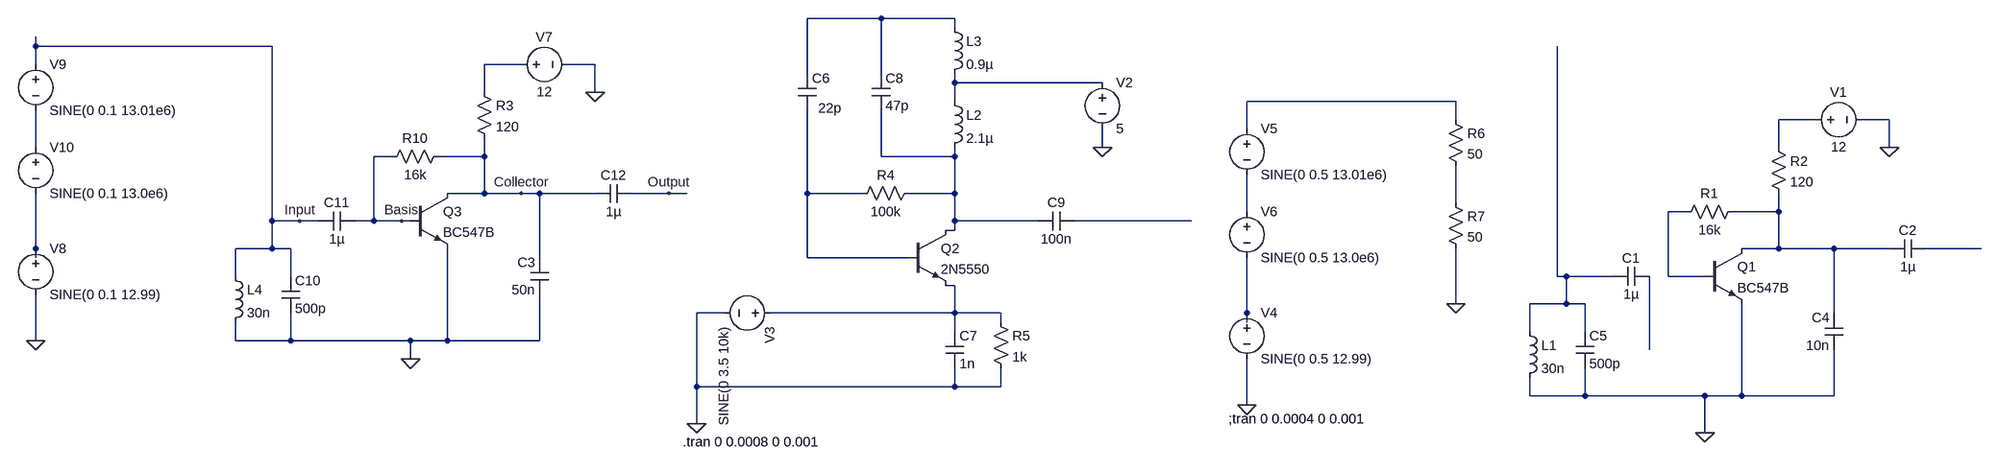
[diagram p0: schematic EmpfängerRadioWorking!!!!!!.asc]
EmpfängerRadioWorking!!!!!!.asc, the LTspice schematic file:
Version 4
SHEET 1 5860 680
WIRE 3872 -224 3744 -224
WIRE 4000 -224 3872 -224
WIRE 4000 -208 4000 -224
WIRE 1584 -176 1584 -192
WIRE 2816 -176 1584 -176
WIRE 1584 -144 1584 -176
WIRE 3248 -144 3184 -144
WIRE 3376 -144 3328 -144
WIRE 3744 -128 3744 -224
WIRE 3872 -128 3872 -224
WIRE 4000 -112 4000 -128
WIRE 4256 -112 4000 -112
WIRE 3184 -96 3184 -144
WIRE 3376 -96 3376 -144
WIRE 4000 -80 4000 -112
WIRE 4944 -80 4560 -80
WIRE 4944 -48 4944 -80
WIRE 5568 -48 5504 -48
WIRE 5696 -48 5648 -48
WIRE 4560 -32 4560 -80
WIRE 1584 0 1584 -64
WIRE 4256 0 4256 -32
WIRE 5504 0 5504 -48
WIRE 5696 0 5696 -48
WIRE 3024 16 2992 16
WIRE 3184 16 3184 -16
WIRE 3184 16 3104 16
WIRE 3872 16 3872 -64
WIRE 4000 16 4000 0
WIRE 4000 16 3872 16
WIRE 3184 80 3184 16
WIRE 3184 80 3120 80
WIRE 3248 80 3184 80
WIRE 3280 80 3248 80
WIRE 3376 80 3280 80
WIRE 3504 80 3440 80
WIRE 3536 80 3504 80
WIRE 3744 80 3744 -64
WIRE 3840 80 3744 80
WIRE 4000 80 4000 16
WIRE 4000 80 3920 80
WIRE 4944 96 4944 32
WIRE 4560 112 4560 48
WIRE 5344 112 5312 112
WIRE 5504 112 5504 80
WIRE 5504 112 5424 112
WIRE 2816 128 2816 -176
WIRE 2864 128 2816 128
WIRE 2896 128 2864 128
WIRE 2992 128 2992 16
WIRE 2992 128 2960 128
WIRE 3040 128 2992 128
WIRE 3056 128 3040 128
WIRE 4000 128 4000 80
WIRE 4144 128 4000 128
WIRE 4464 128 4208 128
WIRE 4000 144 4000 128
WIRE 4000 144 3984 144
WIRE 1584 176 1584 80
WIRE 2816 176 2816 128
WIRE 2816 176 2752 176
WIRE 2848 176 2816 176
WIRE 5504 176 5504 112
WIRE 5504 176 5440 176
WIRE 5600 176 5504 176
WIRE 5696 176 5600 176
WIRE 5856 176 5760 176
WIRE 1584 192 1584 176
WIRE 3280 192 3280 80
WIRE 3744 192 3744 80
WIRE 3920 192 3744 192
WIRE 2752 224 2752 176
WIRE 2848 224 2848 176
WIRE 5120 224 5120 -176
WIRE 5136 224 5120 224
WIRE 5216 224 5136 224
WIRE 5312 224 5312 112
WIRE 5376 224 5312 224
WIRE 4000 240 3984 240
WIRE 4944 272 4944 176
WIRE 5136 272 5136 224
WIRE 5136 272 5072 272
WIRE 5168 272 5136 272
WIRE 3600 288 3552 288
WIRE 4000 288 4000 240
WIRE 4000 288 3680 288
WIRE 4080 288 4000 288
WIRE 4560 288 4560 192
WIRE 5600 288 5600 176
WIRE 4080 304 4080 288
WIRE 4560 304 4560 288
WIRE 4000 320 4000 288
WIRE 5072 320 5072 272
WIRE 5168 320 5168 272
WIRE 1584 336 1584 256
WIRE 2752 336 2752 304
WIRE 2848 336 2848 288
WIRE 2848 336 2752 336
WIRE 3056 336 2848 336
WIRE 3120 336 3120 176
WIRE 3120 336 3056 336
WIRE 3280 336 3280 256
WIRE 3280 336 3120 336
WIRE 5280 352 5280 224
WIRE 3056 368 3056 336
WIRE 3552 416 3552 288
WIRE 4000 416 4000 384
WIRE 4000 416 3552 416
WIRE 4080 416 4080 384
WIRE 4080 416 4000 416
WIRE 5072 432 5072 400
WIRE 5168 432 5168 384
WIRE 5168 432 5072 432
WIRE 5376 432 5168 432
WIRE 5440 432 5440 272
WIRE 5440 432 5376 432
WIRE 5600 432 5600 352
WIRE 5600 432 5440 432
WIRE 4560 448 4560 368
WIRE 3552 480 3552 416
WIRE 5376 496 5376 432
FLAG 5376 496 0
FLAG 5696 0 0
FLAG 3552 480 0
FLAG 4256 0 0
FLAG 4560 448 0
FLAG 4944 272 0
FLAG 3056 368 0
FLAG 3376 -96 0
FLAG 1584 336 0
FLAG 3248 80 Collector
FLAG 3504 80 Output
FLAG 2864 128 Input
FLAG 3040 128 Basis
SYMBOL cap 5616 352 R180
WINDOW 0 24 56 Left 2
WINDOW 3 24 8 Left 2
SYMATTR InstName C4
SYMATTR Value 10n
SYMBOL res 5488 -16 R0
SYMATTR InstName R2
SYMATTR Value 120
SYMBOL cap 5152 320 R0
SYMATTR InstName C5
SYMATTR Value 500p
SYMBOL ind 5056 304 R0
SYMATTR InstName L1
SYMATTR Value 30n
SYMBOL npn 5376 176 R0
SYMATTR InstName Q1
SYMATTR Value BC547B
SYMBOL voltage 5552 -48 R270
WINDOW 0 32 56 VTop 2
WINDOW 3 -32 56 VBottom 2
WINDOW 123 0 0 Left 2
WINDOW 39 0 0 Left 2
SYMATTR InstName V1
SYMATTR Value 12
SYMBOL res 3936 64 R90
WINDOW 0 0 56 VBottom 2
WINDOW 3 32 56 VTop 2
SYMATTR InstName R4
SYMATTR Value 100k
SYMBOL res 4064 288 R0
SYMATTR InstName R5
SYMATTR Value 1k
SYMBOL cap 3728 -128 R0
WINDOW 3 35 60 Left 2
SYMATTR Value 22p
SYMATTR InstName C6
SYMBOL cap 3984 320 R0
SYMATTR InstName C7
SYMATTR Value 1n
SYMBOL cap 3856 -128 R0
SYMATTR InstName C8
SYMATTR Value 47p
SYMBOL cap 4208 112 R90
WINDOW 0 0 32 VBottom 2
WINDOW 3 32 32 VTop 2
SYMATTR InstName C9
SYMATTR Value 100n
SYMBOL ind 3984 -96 R0
SYMATTR InstName L2
SYMATTR Value 2.1µ
SYMBOL ind 3984 -224 R0
SYMATTR InstName L3
SYMATTR Value 0.9µ
SYMBOL npn 3920 144 R0
SYMATTR InstName Q2
SYMATTR Value 2N5550
SYMBOL voltage 4256 -128 R0
WINDOW 123 0 0 Left 2
WINDOW 39 0 0 Left 2
SYMATTR InstName V2
SYMATTR Value 5
SYMBOL voltage 3696 288 R90
WINDOW 123 0 0 Left 2
WINDOW 39 0 0 Left 2
SYMATTR InstName V3
SYMATTR Value SINE(0 3.5 10k)
SYMBOL cap 5280 208 R90
WINDOW 0 0 32 VBottom 2
WINDOW 3 32 32 VTop 2
SYMATTR InstName C1
SYMATTR Value 1µ
SYMBOL voltage 4560 272 R0
WINDOW 123 0 0 Left 2
WINDOW 39 0 0 Left 2
SYMATTR InstName V4
SYMATTR Value SINE(0 0.5 12.99)
SYMBOL voltage 4560 -48 R0
WINDOW 123 0 0 Left 2
WINDOW 39 0 0 Left 2
SYMATTR InstName V5
SYMATTR Value SINE(0 0.5 13.01e6)
SYMBOL res 4928 -64 R0
SYMATTR InstName R6
SYMATTR Value 50
SYMBOL res 4928 80 R0
SYMATTR InstName R7
SYMATTR Value 50
SYMBOL voltage 4560 96 R0
WINDOW 123 0 0 Left 2
WINDOW 39 0 0 Left 2
SYMATTR InstName V6
SYMATTR Value SINE(0 0.5 13.0e6)
SYMBOL res 5440 96 R90
WINDOW 0 0 56 VBottom 2
WINDOW 3 32 56 VTop 2
SYMATTR InstName R1
SYMATTR Value 16k
SYMBOL cap 5760 160 R90
WINDOW 0 0 32 VBottom 2
WINDOW 3 32 32 VTop 2
SYMATTR InstName C2
SYMATTR Value 1µ
SYMBOL cap 3296 256 R180
WINDOW 0 24 56 Left 2
WINDOW 3 24 8 Left 2
SYMATTR InstName C3
SYMATTR Value 50n
SYMBOL res 3168 -112 R0
SYMATTR InstName R3
SYMATTR Value 120
SYMBOL cap 2832 224 R0
SYMATTR InstName C10
SYMATTR Value 500p
SYMBOL ind 2736 208 R0
SYMATTR InstName L4
SYMATTR Value 30n
SYMBOL npn 3056 80 R0
SYMATTR InstName Q3
SYMATTR Value BC547B
SYMBOL voltage 3232 -144 R270
WINDOW 0 32 56 VTop 2
WINDOW 3 -32 56 VBottom 2
WINDOW 123 0 0 Left 2
WINDOW 39 0 0 Left 2
SYMATTR InstName V7
SYMATTR Value 12
SYMBOL cap 2960 112 R90
WINDOW 0 0 32 VBottom 2
WINDOW 3 32 32 VTop 2
SYMATTR InstName C11
SYMATTR Value 1µ
SYMBOL voltage 1584 160 R0
WINDOW 123 0 0 Left 2
WINDOW 39 0 0 Left 2
SYMATTR InstName V8
SYMATTR Value SINE(0 0.1 12.99)
SYMBOL voltage 1584 -160 R0
WINDOW 123 0 0 Left 2
WINDOW 39 0 0 Left 2
SYMATTR InstName V9
SYMATTR Value SINE(0 0.1 13.01e6)
SYMBOL voltage 1584 -16 R0
WINDOW 123 0 0 Left 2
WINDOW 39 0 0 Left 2
SYMATTR InstName V10
SYMATTR Value SINE(0 0.1 13.0e6)
SYMBOL res 3120 0 R90
WINDOW 0 0 56 VBottom 2
WINDOW 3 32 56 VTop 2
SYMATTR InstName R10
SYMATTR Value 16k
SYMBOL cap 3440 64 R90
WINDOW 0 0 32 VBottom 2
WINDOW 3 32 32 VTop 2
SYMATTR InstName C12
SYMATTR Value 1µ
TEXT 3528 512 Left 2 !.tran 0 0.0008 0 0.001
TEXT 4528 472 Left 2 !;tran 0 0.0004 0 0.001

The netlist it stands for:
* EmpfängerRadioWorking!!!!!!.asc
C4 0 N012 10n
R2 N005 N012 120
C5 N016 0 500p
L1 N016 0 30n
Q1 N012 N011 0 0 BC547B
V1 N005 0 12
R4 N007 N008 100k
R5 N017 0 1k
C6 N001 N008 22p
C7 N017 0 1n
C8 N001 N007 47p
C9 N013 N007 100n
L2 N003 N007 2.1µ
L3 N001 N003 0.9µ
Q2 N007 N008 N017 0 2N5550
V2 N003 0 5
V3 N017 0 SINE(0 3.5 10k)
C1 N019 N016 1µ
V4 N018 0 SINE(0 0.5 12.99)
V5 N004 N010 SINE(0 0.5 13.01e6)
R6 N004 N009 50
R7 N009 0 50
V6 N010 N018 SINE(0 0.5 13.0e6)
R1 N012 N011 16k
C2 N015 N012 1µ
C3 0 Collector 50n
R3 N002 Collector 120
C10 Input 0 500p
L4 Input 0 30n
Q3 Collector Basis 0 0 BC547B
V7 N002 0 12
C11 Basis Input 1µ
V8 N014 0 SINE(0 0.1 12.99)
V9 Input N006 SINE(0 0.1 13.01e6)
V10 N006 N014 SINE(0 0.1 13.0e6)
R10 Collector Basis 16k
C12 Output Collector 1µ
.model NPN NPN
.model PNP PNP
.lib standard.bjt
.tran 0 0.0008 0 0.001
;tran 0 0.0004 0 0.001
.backanno
.end